# EAGLE schematic C64_2 (EAGLE 5.12)

## Sheet 1 of 5
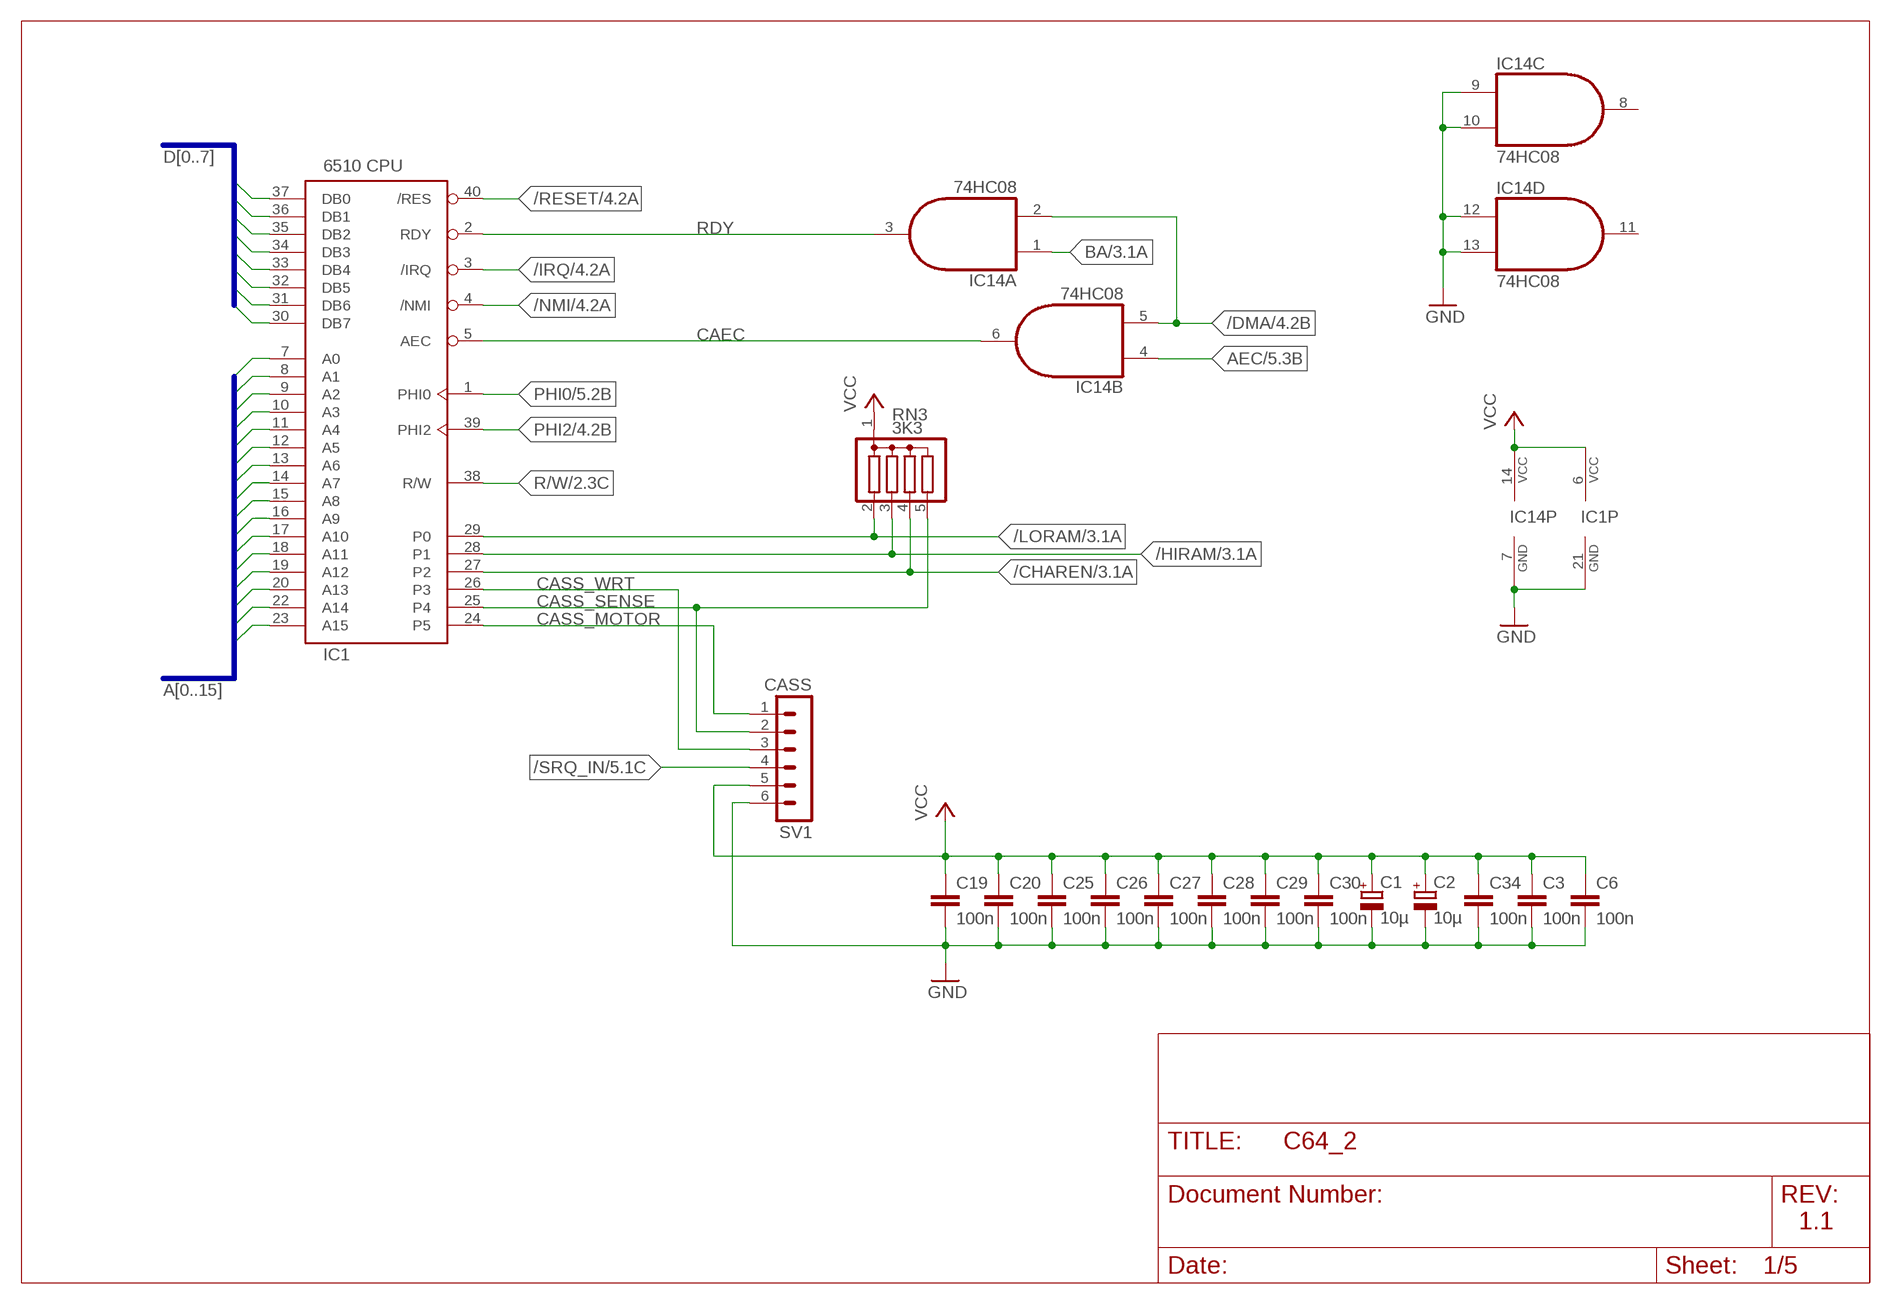
[diagram p0: schematic, sheet 1]

### Parts
C1  10µ  CPOL-EUE2.5-5  [E2,5-5]
C2  10µ  CPOL-EUE2.5-5  [E2,5-5]
C3  100n  C-EU050-024X044  [C050-024X044]
C6  100n  C-EU050-024X044  [C050-024X044]
C19  100n  C-EU050-024X044  [C050-024X044]
C20  100n  C-EU050-024X044  [C050-024X044]
C25  100n  C-EU050-024X044  [C050-024X044]
C26  100n  C-EU050-024X044  [C050-024X044]
C27  100n  C-EU050-024X044  [C050-024X044]
C28  100n  C-EU050-024X044  [C050-024X044]
C29  100n  C-EU050-024X044  [C050-024X044]
C30  100n  C-EU050-024X044  [C050-024X044]
C34  100n  C-EU050-024X044  [C050-024X044]
IC1  6510 CPU  6510  [DIP40]
IC14  74HC08  74LS08N  [DIL14]
RN3  3K3  G04R  [SIL5]
SV1  CASS  MA06-1  [MA06-1]

### Nets
/CHAREN: IC1.27(P2) RN3.4 ; also sheet 3
/DMA: IC14.2(A:I1) IC14.5(B:I1) ; also sheet 4
/HIRAM: IC1.28(P1) RN3.3 ; also sheet 3
/IRQ: IC1.3(/IRQ) ; also sheet 4,5
/LORAM: IC1.29(P0) RN3.2 ; also sheet 3
/NMI: IC1.4(/NMI) ; also sheet 4,5
/RESET: IC1.40(/RES) ; also sheet 4,5
/SRQ_IN: SV1.4 ; also sheet 5
A0: IC1.7(A0) ; also sheet 2,4,5
A1: IC1.8(A1) ; also sheet 2,4,5
A2: IC1.9(A2) ; also sheet 2,4,5
A3: IC1.10(A3) ; also sheet 2,4,5
A4: IC1.11(A4) ; also sheet 2,4,5
A5: IC1.12(A5) ; also sheet 2,4,5
A6: IC1.13(A6) ; also sheet 2,4,5
A7: IC1.14(A7) ; also sheet 2,4,5
A8: IC1.15(A8) ; also sheet 2,3,4,5
A9: IC1.16(A9) ; also sheet 2,3,4,5
A10: IC1.17(A10) ; also sheet 2,3,4,5
A11: IC1.18(A11) ; also sheet 2,3,4,5
A12: IC1.19(A12) ; also sheet 2,3,4,5
A13: IC1.20(A13) ; also sheet 2,3,4,5
A14: IC1.22(A14) ; also sheet 2,3,4,5
A15: IC1.23(A15) ; also sheet 2,3,4,5
AEC: IC14.4(B:I0) ; also sheet 5
BA: IC14.1(A:I0) ; also sheet 3,4,5
CAEC: IC1.5(AEC) IC14.6(B:O)
CASS_MOTOR: IC1.24(P5) SV1.1
CASS_SENSE: IC1.25(P4) RN3.5 SV1.2
CASS_WRT: IC1.26(P3) SV1.3
D0: IC1.37(DB0) ; also sheet 2,4,5
D1: IC1.36(DB1) ; also sheet 2,4,5
D2: IC1.35(DB2) ; also sheet 2,4,5
D3: IC1.34(DB3) ; also sheet 2,4,5
D4: IC1.33(DB4) ; also sheet 2,4,5
D5: IC1.32(DB5) ; also sheet 2,4,5
D6: IC1.31(DB6) ; also sheet 2,4,5
D7: IC1.30(DB7) ; also sheet 2,4,5
GND: C1.- C2.- C3.2 C6.2 C19.2 C20.2 C25.2 C26.2 C27.2 C28.2 C29.2 C30.2 C34.2 IC1.21(GND) IC14.7(P:GND) IC14.9(C:I0) IC14.10(C:I1) IC14.12(D:I0) IC14.13(D:I1) SV1.6 ; also sheet 2,3,4,5
PHI0: IC1.1(PHI0) ; also sheet 5
PHI2: IC1.39(PHI2) ; also sheet 4,5
R/W: IC1.38(R/W) ; also sheet 2,3,4,5
RDY: IC1.2(RDY) IC14.3(A:O)
VCC: C1.+ C2.+ C3.1 C6.1 C19.1 C20.1 C25.1 C26.1 C27.1 C28.1 C29.1 C30.1 C34.1 IC1.6(VCC) IC14.14(P:VCC) RN3.1 SV1.5 ; also sheet 2,3,4,5
Unconnected: IC14.8(C:O) IC14.11(D:O)

### Buses
D[0..7]
A[0..15]

### Notes on the sheet
- 1.1

## Sheet 2 of 5
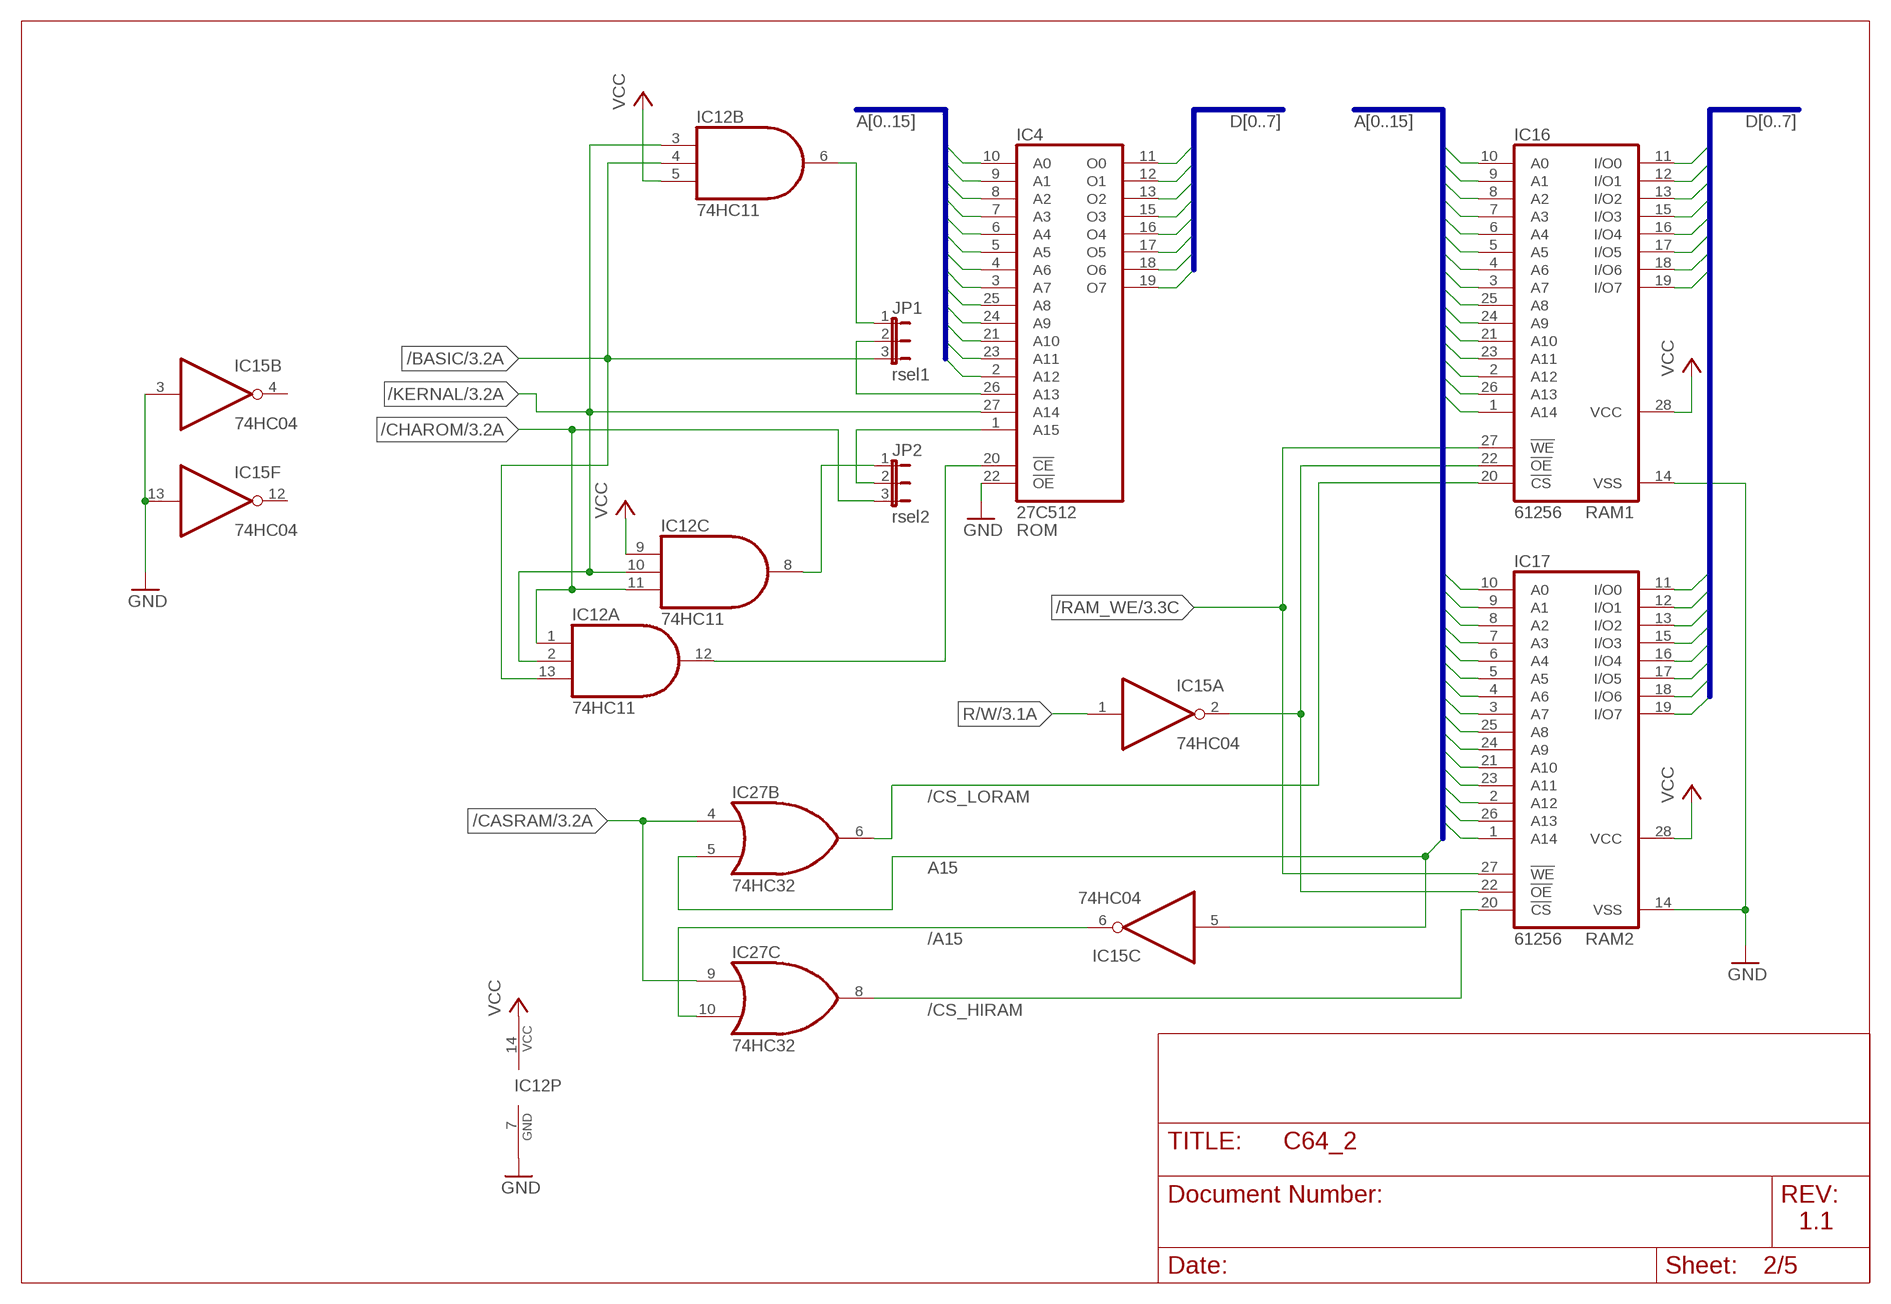
[diagram p1: schematic, sheet 2]

### Parts
IC4  27C512  27512  [DIL28]
IC12  74HC11  74LS11N  [DIL14]
IC15  74HC04  74LS04N  [DIL14]
IC16  61256  62832P  [DIL28-3]
IC17  61256  62832P  [DIL28-3]
IC27  74HC32  7432N  [DIL14]
JP1  rsel1  JP2E  [JP2]
JP2  rsel2  JP2E  [JP2]

### Nets
/A15: IC15.6(C:O) IC27.10(C:I1)
/BASIC: IC12.4(B:I1) IC12.13(A:I2) JP1.3 ; also sheet 3
/CASRAM: IC27.4(B:I0) IC27.9(C:I0) ; also sheet 3
/CHAROM: IC12.1(A:I0) IC12.11(C:I2) JP2.3 ; also sheet 3
/CS_HIRAM: IC17.20(!CS) IC27.8(C:O)
/CS_LORAM: IC16.20(!CS) IC27.6(B:O)
/KERNAL: IC4.27(A14) IC12.2(A:I1) IC12.3(B:I0) IC12.10(C:I1) ; also sheet 3
/OE_RAM: IC15.2(A:O) IC16.22(!OE) IC17.22(!OE)
/RAM_WE: IC16.27(!WE) IC17.27(!WE) ; also sheet 3
/ROM_CS: IC4.20(!CE) IC12.12(A:O)
A0: IC4.10(A0) IC16.10(A0) IC17.10(A0) ; also sheet 1,4,5
A1: IC4.9(A1) IC16.9(A1) IC17.9(A1) ; also sheet 1,4,5
A2: IC4.8(A2) IC16.8(A2) IC17.8(A2) ; also sheet 1,4,5
A3: IC4.7(A3) IC16.7(A3) IC17.7(A3) ; also sheet 1,4,5
A4: IC4.6(A4) IC16.6(A4) IC17.6(A4) ; also sheet 1,4,5
A5: IC4.5(A5) IC16.5(A5) IC17.5(A5) ; also sheet 1,4,5
A6: IC4.4(A6) IC16.4(A6) IC17.4(A6) ; also sheet 1,4,5
A7: IC4.3(A7) IC16.3(A7) IC17.3(A7) ; also sheet 1,4,5
A8: IC4.25(A8) IC16.25(A8) IC17.25(A8) ; also sheet 1,3,4,5
A9: IC4.24(A9) IC16.24(A9) IC17.24(A9) ; also sheet 1,3,4,5
A10: IC4.21(A10) IC16.21(A10) IC17.21(A10) ; also sheet 1,3,4,5
A11: IC4.23(A11) IC16.23(A11) IC17.23(A11) ; also sheet 1,3,4,5
A12: IC4.2(A12) IC16.2(A12) IC17.2(A12) ; also sheet 1,3,4,5
A13: IC16.26(A13) IC17.26(A13) ; also sheet 1,3,4,5
A14: IC16.1(A14) IC17.1(A14) ; also sheet 1,3,4,5
A15: IC15.5(C:I) IC27.5(B:I1) ; also sheet 1,3,4,5
D0: IC4.11(O0) IC16.11(I/O0) IC17.11(I/O0) ; also sheet 1,4,5
D1: IC4.12(O1) IC16.12(I/O1) IC17.12(I/O1) ; also sheet 1,4,5
D2: IC4.13(O2) IC16.13(I/O2) IC17.13(I/O2) ; also sheet 1,4,5
D3: IC4.15(O3) IC16.15(I/O3) IC17.15(I/O3) ; also sheet 1,4,5
D4: IC4.16(O4) IC16.16(I/O4) IC17.16(I/O4) ; also sheet 1,4,5
D5: IC4.17(O5) IC16.17(I/O5) IC17.17(I/O5) ; also sheet 1,4,5
D6: IC4.18(O6) IC16.18(I/O6) IC17.18(I/O6) ; also sheet 1,4,5
D7: IC4.19(O7) IC16.19(I/O7) IC17.19(I/O7) ; also sheet 1,4,5
GND: IC4.22(!OE) IC12.7(P:GND) IC15.3(B:I) IC15.13(F:I) IC16.14(VSS) IC17.14(VSS) ; also sheet 1,3,4,5
N$16: IC4.1(A15) JP2.2
N$17: IC12.8(C:O) JP2.1
N$23: IC12.6(B:O) JP1.1
R/W: IC15.1(A:I) ; also sheet 1,3,4,5
ROM_A13: IC4.26(A13) JP1.2
VCC: IC12.5(B:I2) IC12.9(C:I0) IC12.14(P:VCC) IC16.28(VCC) IC17.28(VCC) ; also sheet 1,3,4,5
Unconnected: IC15.4(B:O) IC15.12(F:O)

### Buses
D[0..7]
A[0..15]

### Notes on the sheet
- RAM1
- ROM
- RAM2
- 1.1

## Sheet 3 of 5
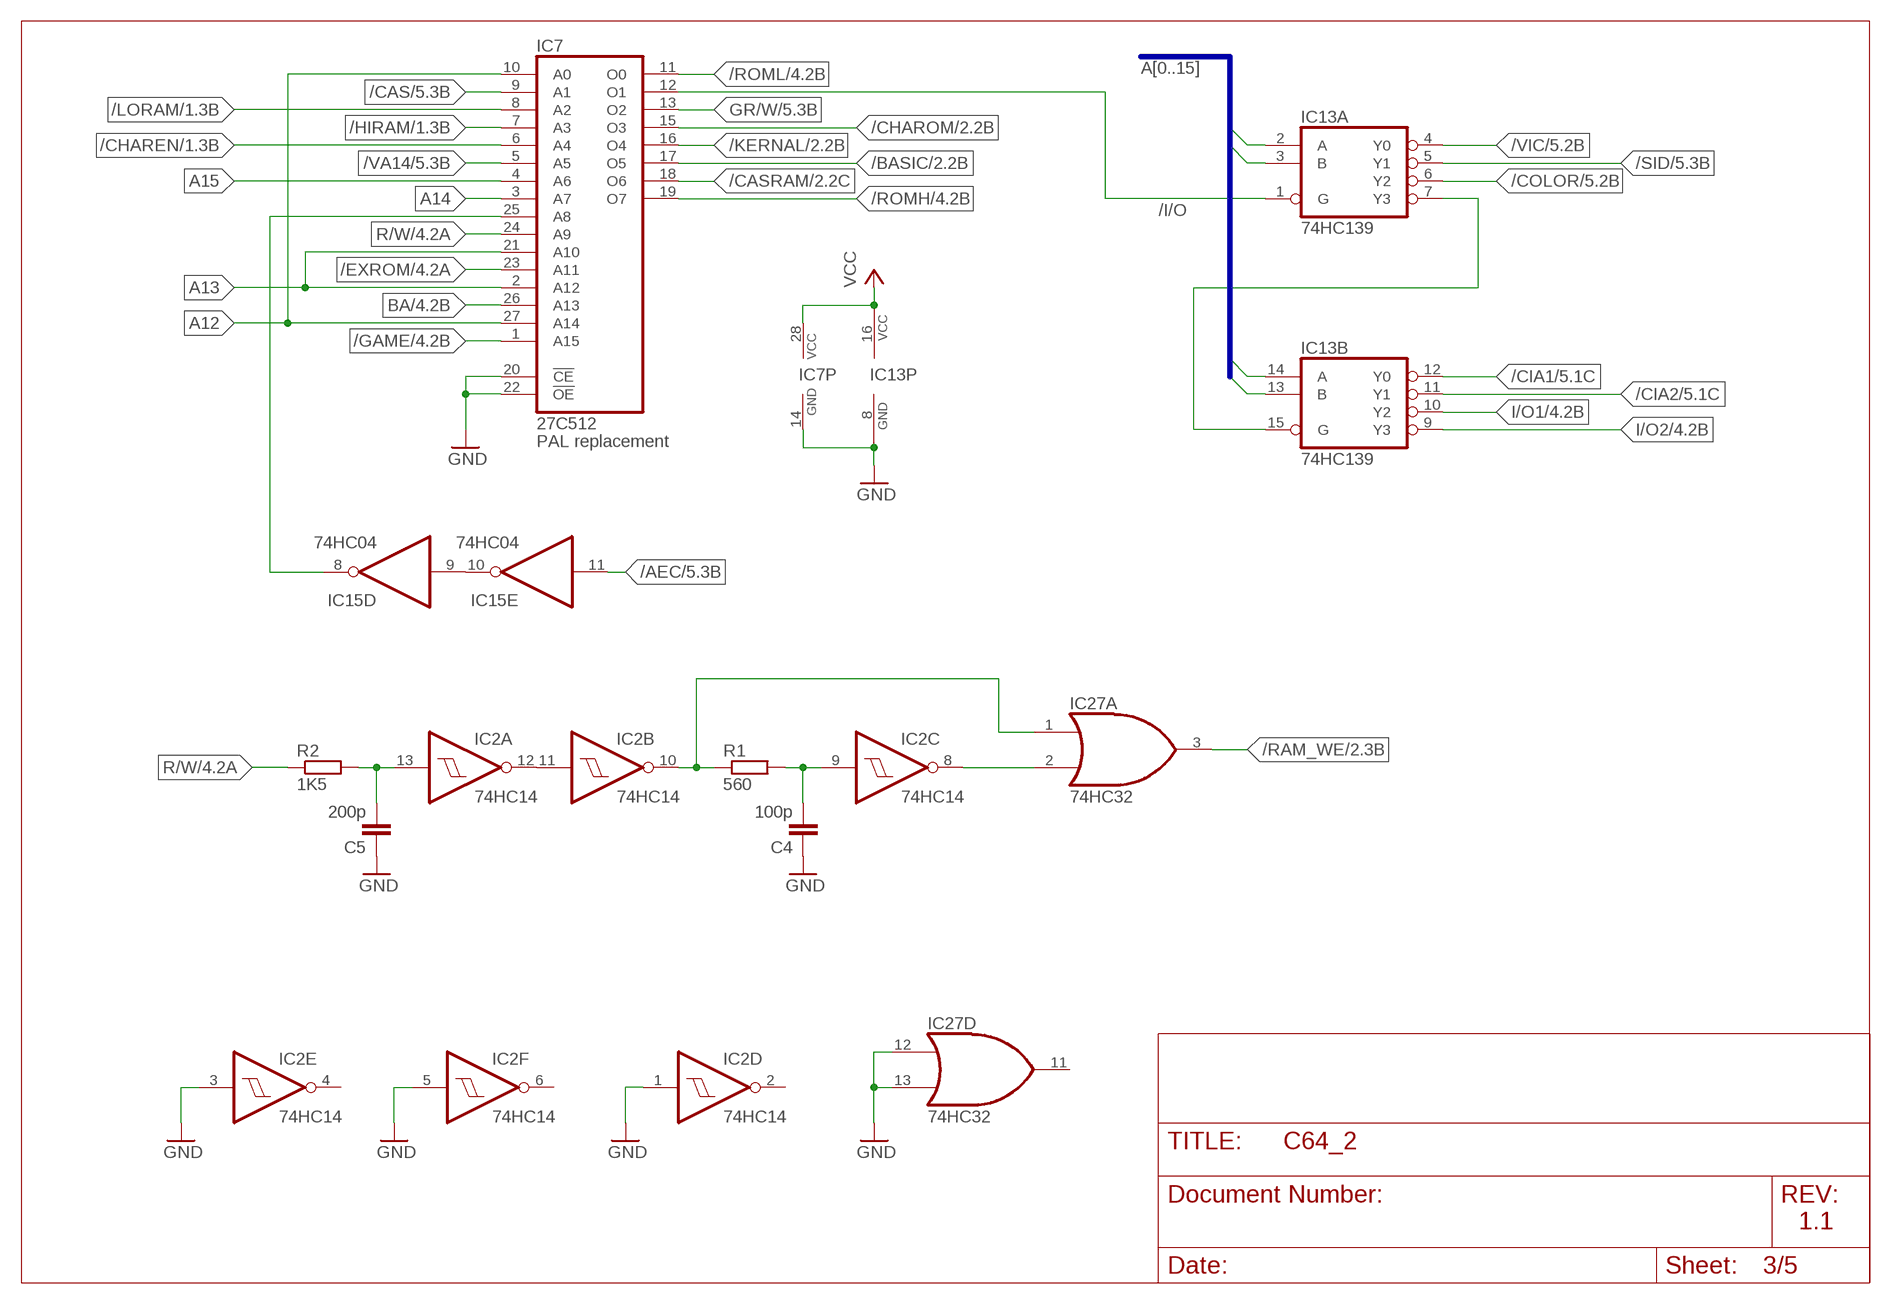
[diagram p2: schematic, sheet 3]

### Parts
C4  100p  C-EU050-024X044  [C050-024X044]
C5  200p  C-EU050-024X044  [C050-024X044]
IC2  74HC14  7414N  [DIL14]
IC7  27C512  27512  [DIL28]
IC13  74HC139  74LS139N  [DIL16]
R1  560  R-EU_0207/2V  [0207/2V]
R2  1K5  R-EU_0207/2V  [0207/2V]

### Nets
/AEC: IC15.11(E:I) ; also sheet 5
/BASIC: IC7.17(O5) ; also sheet 2
/CAS: IC7.9(A1) ; also sheet 5
/CASRAM: IC7.18(O6) ; also sheet 2
/CHAREN: IC7.6(A4) ; also sheet 1
/CHAROM: IC7.15(O3) ; also sheet 2
/CIA1: IC13.12(B:Y0) ; also sheet 5
/CIA2: IC13.11(B:Y1) ; also sheet 5
/CIAS: IC13.7(A:Y3) IC13.15(B:G)
/COLOR: IC13.6(A:Y2) ; also sheet 5
/EXROM: IC7.23(A11) ; also sheet 4
/GAME: IC7.1(A15) ; also sheet 4
/HIRAM: IC7.7(A3) ; also sheet 1
/I/O: IC7.12(O1) IC13.1(A:G)
/KERNAL: IC7.16(O4) ; also sheet 2
/LORAM: IC7.8(A2) ; also sheet 1
/PAL_AEC: IC7.25(A8) IC15.8(D:O)
/RAM_WE: IC27.3(A:O) ; also sheet 2
/ROMH: IC7.19(O7) ; also sheet 4
/ROML: IC7.11(O0) ; also sheet 4
/SID: IC13.5(A:Y1) ; also sheet 5
/VA14: IC7.5(A5) ; also sheet 5
/VIC: IC13.4(A:Y0) ; also sheet 5
A8: IC13.14(B:A) ; also sheet 1,2,4,5
A9: IC13.13(B:B) ; also sheet 1,2,4,5
A10: IC13.2(A:A) ; also sheet 1,2,4,5
A11: IC13.3(A:B) ; also sheet 1,2,4,5
A12: IC7.10(A0) IC7.27(A14) ; also sheet 1,2,4,5
A13: IC7.2(A12) IC7.21(A10) ; also sheet 1,2,4,5
A14: IC7.3(A7) ; also sheet 1,2,4,5
A15: IC7.4(A6) ; also sheet 1,2,4,5
BA: IC7.26(A13) ; also sheet 1,4,5
GND: C4.1 C5.1 IC2.1(D:I) IC2.3(E:I) IC2.5(F:I) IC7.14(GND) IC7.20(!CE) IC7.22(!OE) IC13.8(P:GND) IC27.12(D:I0) IC27.13(D:I1) ; also sheet 1,2,4,5
GR/W: IC7.13(O2) ; also sheet 5
I/O1: IC13.10(B:Y2) ; also sheet 4
I/O2: IC13.9(B:Y3) ; also sheet 4
N$2: IC2.11(B:I) IC2.12(A:O)
N$3: IC2.8(C:O) IC27.2(A:I1)
N$4: C5.2 IC2.13(A:I) R2.2
N$5: IC2.10(B:O) IC27.1(A:I0) R1.1
N$6: C4.2 IC2.9(C:I) R1.2
N$7: IC15.9(D:I) IC15.10(E:O)
R/W: IC7.24(A9) R2.1 ; also sheet 1,2,4,5
VCC: IC7.28(VCC) IC13.16(P:VCC) ; also sheet 1,2,4,5
Unconnected: IC2.2(D:O) IC2.4(E:O) IC2.6(F:O) IC27.11(D:O)

### Buses
A[0..15]

### Notes on the sheet
- PAL replacement
- 1.1

## Sheet 4 of 5
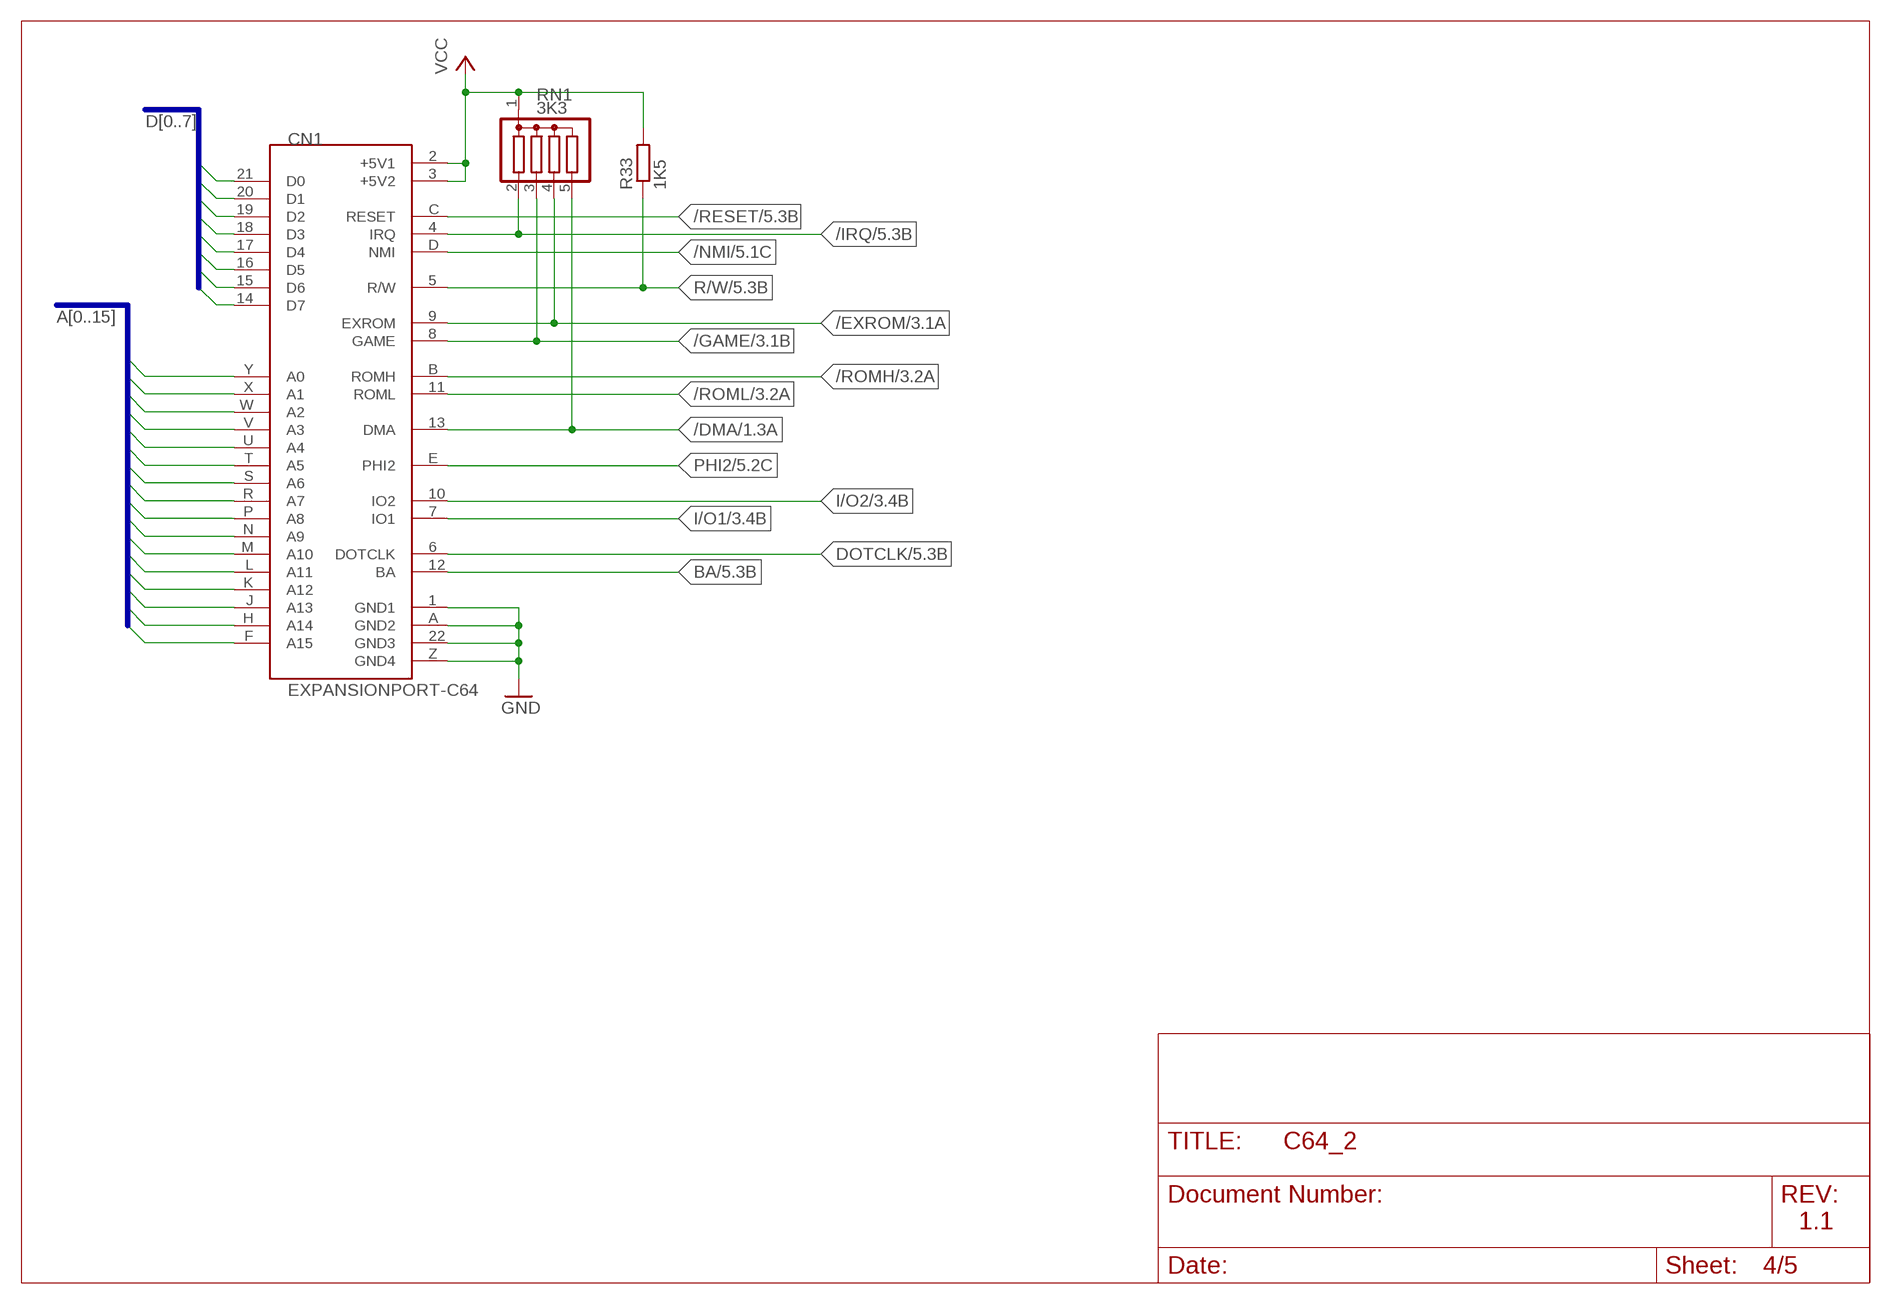
[diagram p3: schematic, sheet 4]

### Parts
CN1  EXPANSIONPORT-C64  [EXPANSIONPORT]
R33  1K5  R-EU_0207/10  [0207/10]
RN1  3K3  G04R  [SIL5]

### Nets
/DMA: CN1.13(DMA) RN1.5 ; also sheet 1
/EXROM: CN1.9(EXROM) RN1.4 ; also sheet 3
/GAME: CN1.8(GAME) RN1.3 ; also sheet 3
/IRQ: CN1.4(IRQ) RN1.2 ; also sheet 1,5
/NMI: CN1.D(NMI) ; also sheet 1,5
/RESET: CN1.C(RESET) ; also sheet 1,5
/ROMH: CN1.B(ROMH) ; also sheet 3
/ROML: CN1.11(ROML) ; also sheet 3
A0: CN1.Y(A0) ; also sheet 1,2,5
A1: CN1.X(A1) ; also sheet 1,2,5
A2: CN1.W(A2) ; also sheet 1,2,5
A3: CN1.V(A3) ; also sheet 1,2,5
A4: CN1.U(A4) ; also sheet 1,2,5
A5: CN1.T(A5) ; also sheet 1,2,5
A6: CN1.S(A6) ; also sheet 1,2,5
A7: CN1.R(A7) ; also sheet 1,2,5
A8: CN1.P(A8) ; also sheet 1,2,3,5
A9: CN1.N(A9) ; also sheet 1,2,3,5
A10: CN1.M(A10) ; also sheet 1,2,3,5
A11: CN1.L(A11) ; also sheet 1,2,3,5
A12: CN1.K(A12) ; also sheet 1,2,3,5
A13: CN1.J(A13) ; also sheet 1,2,3,5
A14: CN1.H(A14) ; also sheet 1,2,3,5
A15: CN1.F(A15) ; also sheet 1,2,3,5
BA: CN1.12(BA) ; also sheet 1,3,5
D0: CN1.21(D0) ; also sheet 1,2,5
D1: CN1.20(D1) ; also sheet 1,2,5
D2: CN1.19(D2) ; also sheet 1,2,5
D3: CN1.18(D3) ; also sheet 1,2,5
D4: CN1.17(D4) ; also sheet 1,2,5
D5: CN1.16(D5) ; also sheet 1,2,5
D6: CN1.15(D6) ; also sheet 1,2,5
D7: CN1.14(D7) ; also sheet 1,2,5
DOTCLK: CN1.6(DOTCLK) ; also sheet 5
GND: CN1.1(GND1) CN1.22(GND3) CN1.A(GND2) CN1.Z(GND4) ; also sheet 1,2,3,5
I/O1: CN1.7(IO1) ; also sheet 3
I/O2: CN1.10(IO2) ; also sheet 3
PHI2: CN1.E(PHI2) ; also sheet 1,5
R/W: CN1.5(R/W) R33.1 ; also sheet 1,2,3,5
VCC: CN1.2(+5V1) CN1.3(+5V2) R33.2 RN1.1 ; also sheet 1,2,3,5

### Buses
D[0..7]
A[0..15]

### Notes on the sheet
- 1.1

## Sheet 5 of 5
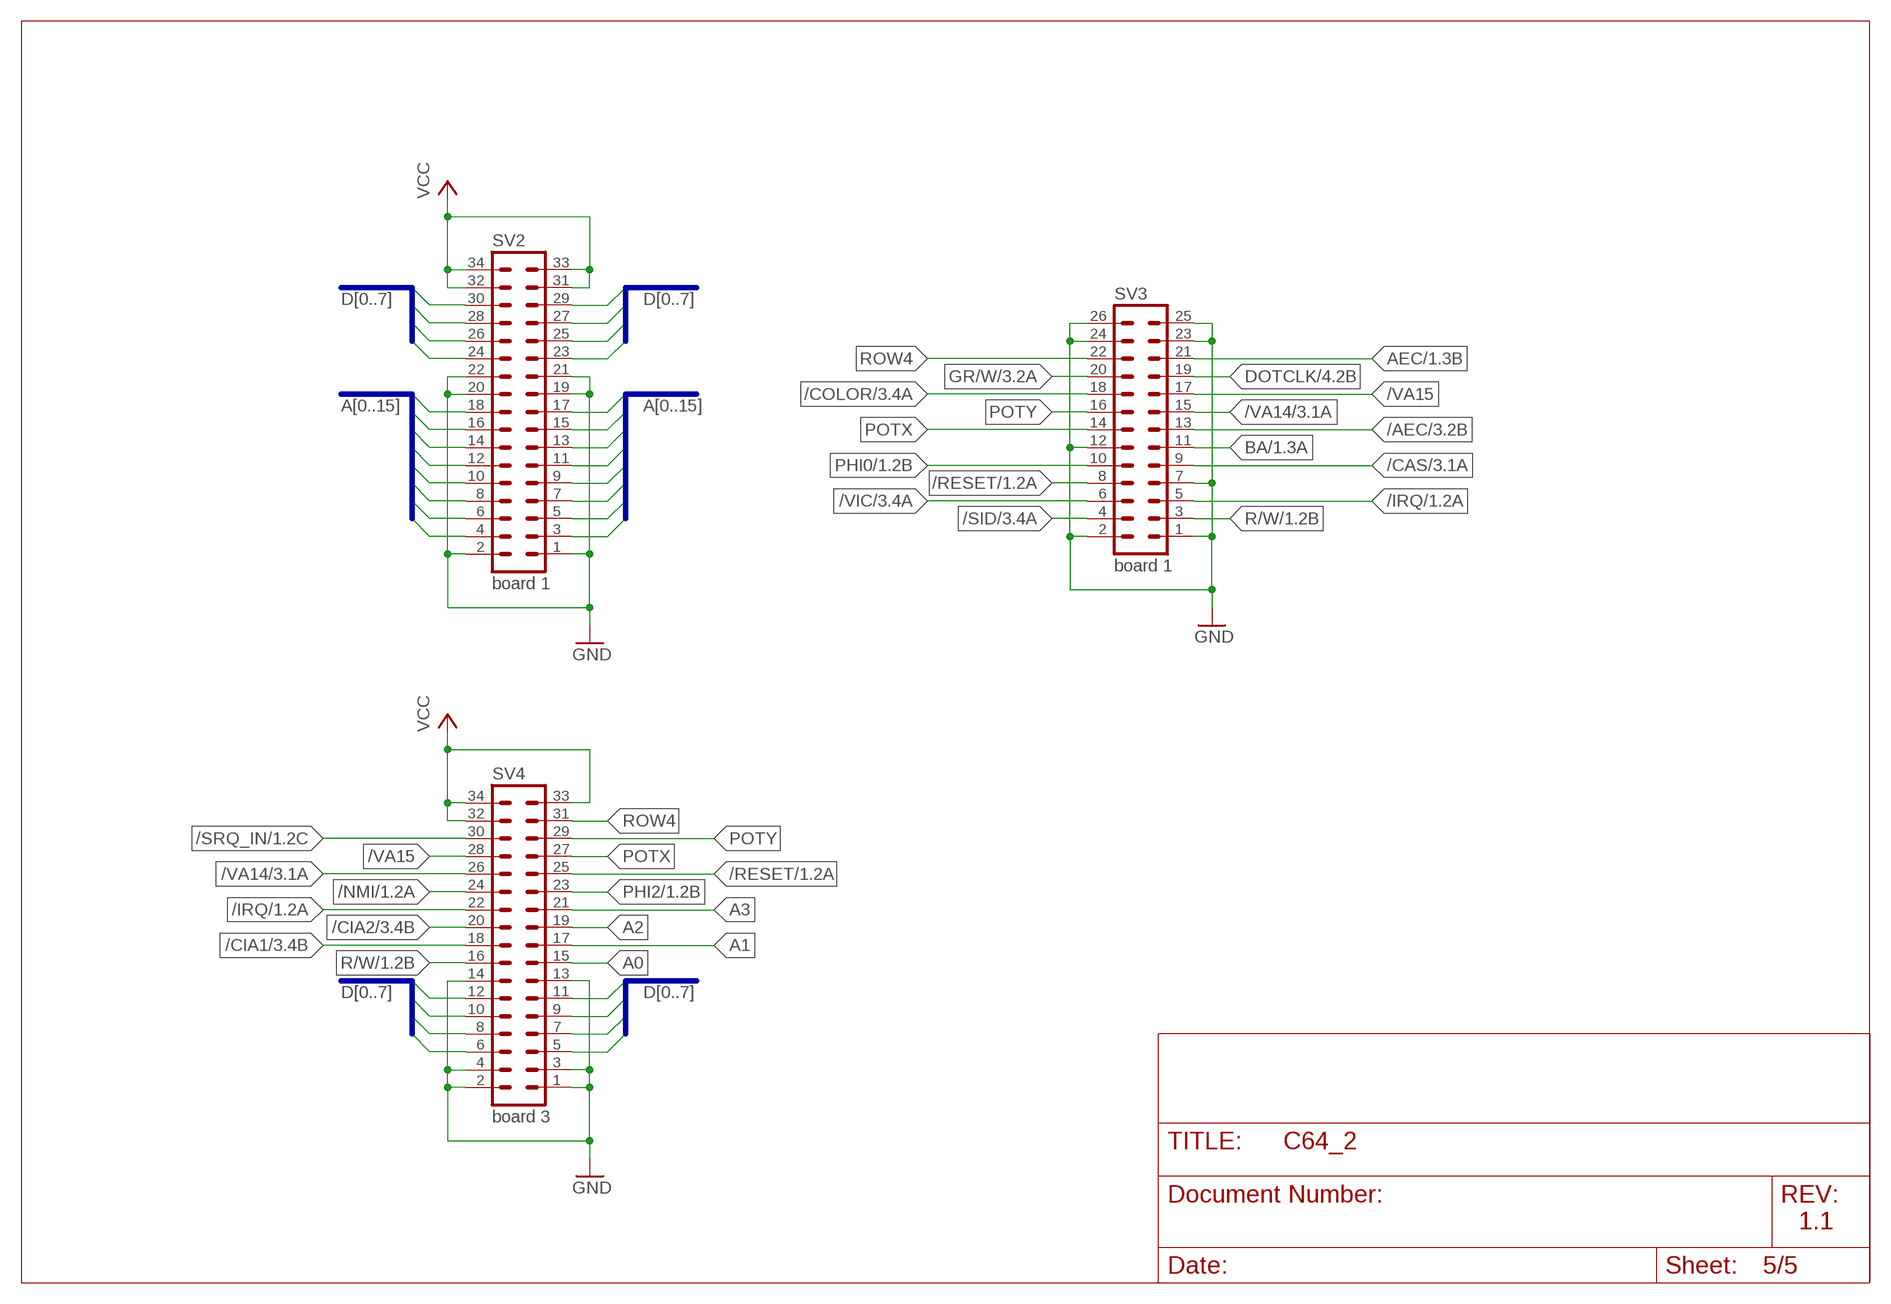
[diagram p4: schematic, sheet 5]

### Parts
SV2  board 1  MA17-2  [MA17-2]
SV3  board 1  MA13-2  [MA13-2]
SV4  board 3  MA17-2  [MA17-2]

### Nets
/AEC: SV3.13 ; also sheet 3
/CAS: SV3.9 ; also sheet 3
/CIA1: SV4.18 ; also sheet 3
/CIA2: SV4.20 ; also sheet 3
/COLOR: SV3.18 ; also sheet 3
/IRQ: SV3.5 SV4.22 ; also sheet 1,4
/NMI: SV4.24 ; also sheet 1,4
/RESET: SV3.8 SV4.25 ; also sheet 1,4
/SID: SV3.4 ; also sheet 3
/SRQ_IN: SV4.30 ; also sheet 1
/VA14: SV3.15 SV4.26 ; also sheet 3
/VA15: SV3.17 SV4.28
/VIC: SV3.6 ; also sheet 3
A0: SV2.3 SV4.15 ; also sheet 1,2,4
A1: SV2.4 SV4.17 ; also sheet 1,2,4
A2: SV2.5 SV4.19 ; also sheet 1,2,4
A3: SV2.6 SV4.21 ; also sheet 1,2,4
A4: SV2.7 ; also sheet 1,2,4
A5: SV2.8 ; also sheet 1,2,4
A6: SV2.9 ; also sheet 1,2,4
A7: SV2.10 ; also sheet 1,2,4
A8: SV2.11 ; also sheet 1,2,3,4
A9: SV2.12 ; also sheet 1,2,3,4
A10: SV2.13 ; also sheet 1,2,3,4
A11: SV2.14 ; also sheet 1,2,3,4
A12: SV2.15 ; also sheet 1,2,3,4
A13: SV2.16 ; also sheet 1,2,3,4
A14: SV2.17 ; also sheet 1,2,3,4
A15: SV2.18 ; also sheet 1,2,3,4
AEC: SV3.21 ; also sheet 1
BA: SV3.11 ; also sheet 1,3,4
D0: SV2.23 SV4.5 ; also sheet 1,2,4
D1: SV2.24 SV4.6 ; also sheet 1,2,4
D2: SV2.25 SV4.7 ; also sheet 1,2,4
D3: SV2.26 SV4.8 ; also sheet 1,2,4
D4: SV2.27 SV4.9 ; also sheet 1,2,4
D5: SV2.28 SV4.10 ; also sheet 1,2,4
D6: SV2.29 SV4.11 ; also sheet 1,2,4
D7: SV2.30 SV4.12 ; also sheet 1,2,4
DOTCLK: SV3.19 ; also sheet 4
GND: SV2.1 SV2.2 SV2.19 SV2.20 SV2.21 SV2.22 SV3.1 SV3.2 SV3.7 SV3.12 SV3.23 SV3.24 SV3.25 SV3.26 SV4.1 SV4.2 SV4.3 SV4.4 SV4.13 SV4.14 ; also sheet 1,2,3,4
GR/W: SV3.20 ; also sheet 3
PHI0: SV3.10 ; also sheet 1
PHI2: SV4.23 ; also sheet 1,4
POTX: SV3.14 SV4.27
POTY: SV3.16 SV4.29
R/W: SV3.3 SV4.16 ; also sheet 1,2,3,4
ROW4: SV3.22 SV4.31
VCC: SV2.31 SV2.32 SV2.33 SV2.34 SV4.32 SV4.33 SV4.34 ; also sheet 1,2,3,4

### Buses
A[0..15]
D[0..7]

### Notes on the sheet
- 1.1

## Power pins joined to a net without a drawn wire
GND: IC2.7(P:GND) IC4.14(GND) IC15.7(P:GND) IC27.7(P:GND)
VCC: IC2.14(P:VCC) IC4.28(VCC) IC15.14(P:VCC) IC27.14(P:VCC)

## Library data of the parts
C1 C2 = rcl:CPOL-EU: POLARIZED CAPACITOR, European symbol
C3-C6 C19 C20 C25-C30 C34 = rcl:C-EU: CAPACITOR, European symbol
CN1 = 0RB_Commodore:EXPANSIONPORT-C64
IC1 = 0RB_65xx:6510: Processor used in Commodore 64 and VIC-10
IC2 = 74xx-us:74*14: Hex schmitt trigger INVERTER
IC4 IC7 = memory:27512: MEMORY
IC12 = 74xx-us:74*11: Triple 3-input AND gate
IC13 = 74xx-us:74*139: Dual 2-line to 4-line DECODER/DEMULTIPLEXER
IC14 = 74xx-us:74*08: Quad 2-input AND gate
IC15 = 74xx-us:74*04: Hex INVERTER
IC16 IC17 = memory-hitachi:62832P: MEMORY; OC_FARNELL: unknown; OC_NEWARK: unknown
IC27 = 74xx-us:74*32: Quad 2-input OR gate
JP1 JP2 = jumper:JP2E: JUMPER
R1 R2 R33 = rcl:R-EU_: RESISTOR, European symbol
RN1 RN3 = resistor-sil:G04R: SIL RESISTOR; OC_FARNELL: unknown; OC_NEWARK: unknown
SV1 = con-lstb:MA06-1: PIN HEADER; OC_FARNELL: unknown; OC_NEWARK: unknown
SV2 SV4 = con-lstb:MA17-2: PIN HEADER; OC_FARNELL: unknown; OC_NEWARK: unknown
SV3 = con-lstb:MA13-2: PIN HEADER; OC_FARNELL: unknown; OC_NEWARK: unknown